# Altium schematic sheet V1.0.SchDoc
size 114 x 63 mm
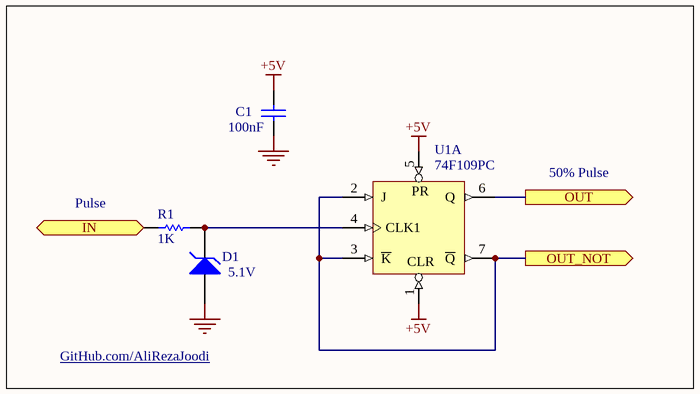
[diagram p0: V1.0.SchDoc]

## Parts
C1  100nF  [CAPNTO2.54-3.05x1.78A]
D1  5.1V  [DIODE0.4_Glass]
R1  1K  [AXIAL-0.4]
U1  74F109PC  [N16E]  (part A of 2)

## Ports
IN (in), OUT (out), OUT_NOT (out)

## Nets
+5V: C1.2 U1.1(CLR) U1.5(PR)
GND: C1.1 D1.1(A) U1.8(GND)
VCC: U1.16(VCC)
IN: R1.2 ; port IN
OUT: U1.6(Q) ; port OUT
OUT_NOT: U1.2(J) U1.3(~{K}) U1.7(~{Q}) ; port OUT_NOT
NetD1_2: D1.2(K) R1.1 U1.4(CLK1)

## Notes on the sheet
- 50% Pulse
- (near R1) Pulse
- GitHub.com/AliRezaJoodi

## Library data of the parts
C1 = Cap: Capacitor; Manufacturer: Generic Components; Class I: Passive; Published: 8-Jun-2000; Revision: July-2002: Re-released for DXP Platform.; Publisher: Altium Limited; Class II: Capacitor
D1 = D Zener: Zener Diode; Manufacturer: Generic Components; Class I: Discrete; Class II: Diode - Zener; Published: 8-Jun-2000; Revision: July-2002: Re-released for DXP Platform.; Publisher: Altium Limited
R1 = Res1: Resistor; Published: 8-Jun-2000; LatestRevisionDate: 17-Jul-2002; LatestRevisionNote: Re-released for DXP Platform.; PackageReference: AXIAL-0.3; Publisher: Altium Limited
U1 = 74F109PC: Dual J-K Positive Edge-Triggered Flip-Flop; Published: 17-Jul-2002; LatestRevisionDate: 29-May-2009; LatestRevisionNote: Component Body Added.; DatasheetVersion: Nov-1999; PackageVersion: 2000; PackageReference: N16E; Publisher: Altium Limited; PackageDescription: DIP, 16-Pin, Row Spacing 7.62 mm, Pitch 2.54 mm; ComponentLink1Description: Manufacturer Link; ComponentLink1URL: http://www.fairchildsemi.com/; ComponentLink2Description: Datasheet; ComponentLink2URL: http://www.fairchildsemi.com/ds/74%2F74F109.pdf